# Altium schematic sheet Motor_Control.SchDoc
size A
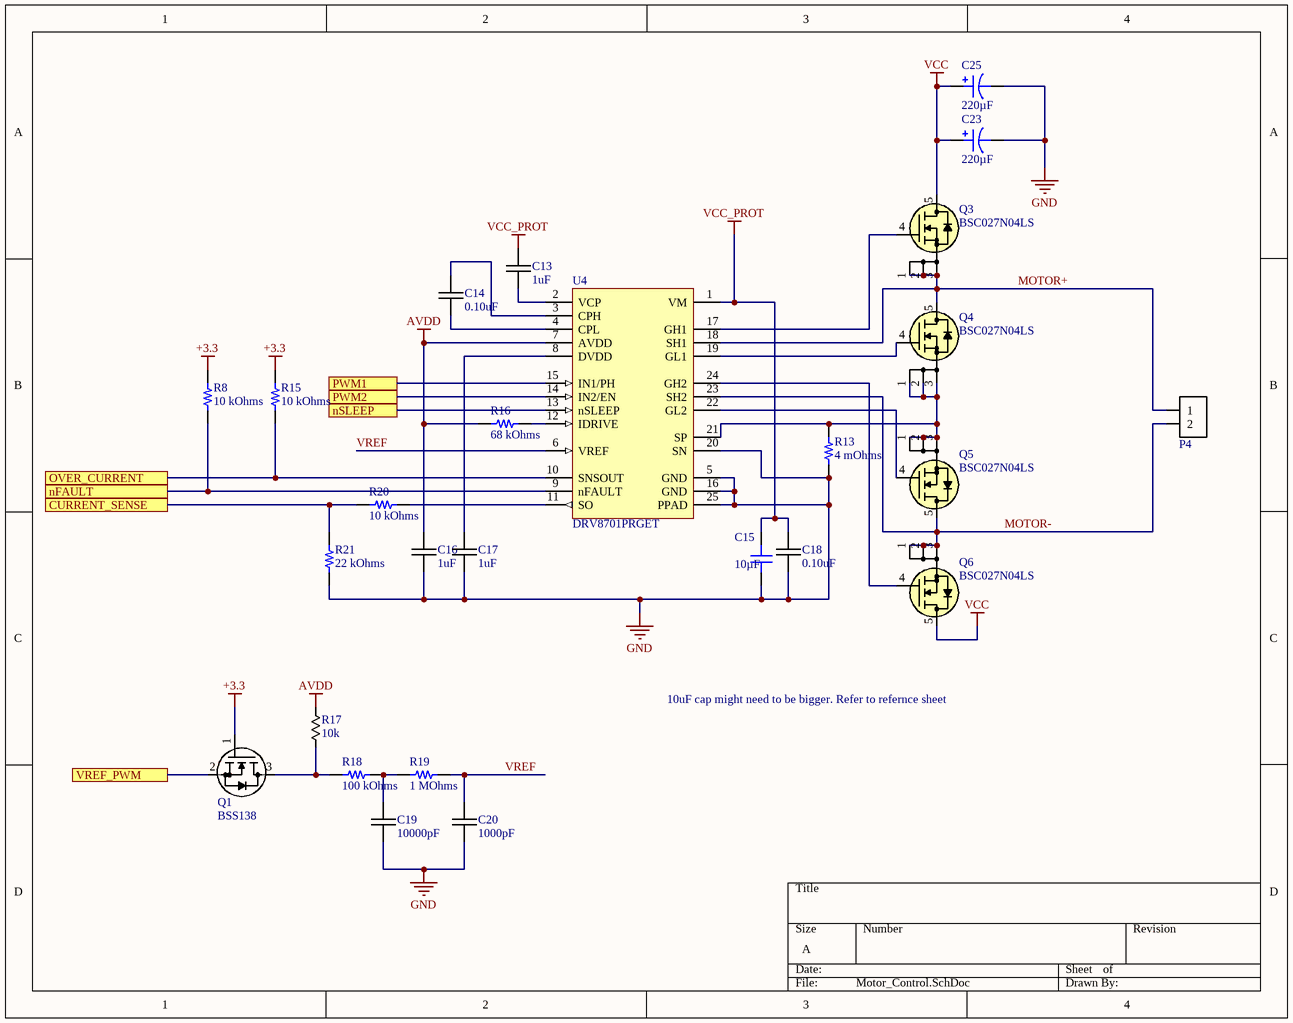
[diagram p0: Motor_Control.SchDoc]

## Parts
C13  1uF  [chip_0805]
C14  0.10uF  [chip_0805]
C15  10µF  [CAP 1206_3216 - 1.8MM]
C16  1uF  [chip_0805]
C17  1uF  [chip_0805]
C18  0.10uF  [chip_0805]
C19  10000pF  [chip_0805]
C20  1000pF  [chip_0603]
C23  220µF  [CAP TH ALUM ELEC D10.00mm S5.00mm H13.50mm]
C25  220µF  [CAP TH ALUM ELEC D10.00mm S5.00mm H13.50mm]
P4  conn-2x1_0  [BARR_0.5IN_2x1_0]  (value not drawn)
Q1  Manufacturer PN: BSS138  [sot-23-3]  (hidden comment: n-mosfet_1)
Q3  BSC027N04LS  [TDFN-8-5x6]
Q4  BSC027N04LS  [TDFN-8-5x6]
Q5  BSC027N04LS  [TDFN-8-5x6]
Q6  BSC027N04LS  [TDFN-8-5x6]
R8  10 kOhms  [RES 0805_2012]
R13  4 mOhms  [RES 2512_6432]
R15  10 kOhms  [RES 0805_2012]
R16  68 kOhms  [RES 0805_2012]
R17  10k  [chip_0805]
R18  100 kOhms  [RES 0603_1608]
R19  1 MOhms  [RES 0603_1608]
R20  10 kOhms  [RES 0805_2012]
R21  22 kOhms  [RES 0805_2012]
U4  DRV8701PRGET  [VQFN-24-EP]

## Ports
CURRENT_SENSE, nFAULT, nSLEEP, OVER_CURRENT, PWM1, PWM2, VREF_PWM

## Nets
+3.3: Q1.1(G) R8.2 R15.2
AVDD: C16.1 R16.1 R17.1 U4.7(AVDD)
GND: C15.1 C16.2 C17.2 C18.2 C19.2 C20.2 C23.2 C25.2 R13.1 R21.1 U4.5(GND) U4.16(GND) U4.20(SN) U4.25(PPAD)
VCC: C23.1 C25.1 Q3.5(D) Q6.5(D)
VCC_PROT: C13.1 C15.2 C18.1 U4.1(VM)
CURRENT_SENSE: R20.2 R21.2 ; port CURRENT_SENSE
MOTOR+: P4.1 Q3.1(S) Q3.2(S) Q3.3(S) Q4.5(D) U4.18(SH1)
MOTOR-: P4.2 Q5.5(D) Q6.1(S) Q6.2(S) Q6.3(S) U4.23(SH2)
nFAULT: R8.1 U4.9(nFAULT) ; port nFAULT
nSLEEP: U4.13(nSLEEP) ; port nSLEEP
OVER_CURRENT: R15.1 U4.10(SNSOUT) ; port OVER_CURRENT
PWM1: U4.15(IN1/PH) ; port PWM1
PWM2: U4.14(IN2/EN) ; port PWM2
VREF: C20.1 R19.2 U4.6(VREF)
VREF_PWM: Q1.2(S) ; port VREF_PWM
NetC13_2: C13.2 U4.2(VCP)
NetC14_1: C14.1 U4.3(CPH)
NetC14_2: C14.2 U4.4(CPL)
NetC17_1: C17.1 U4.8(DVDD)
NetC19_1: C19.1 R18.2 R19.1
NetQ1_3: Q1.3(D) R17.2 R18.1
NetQ3_4: Q3.4(G) U4.17(GH1)
NetQ4_1: Q4.1(S) Q4.2(S) Q4.3(S) Q5.1(S) Q5.2(S) Q5.3(S) R13.2 U4.21(SP)
NetQ4_4: Q4.4(G) U4.19(GL1)
NetQ5_4: Q5.4(G) U4.22(GL2)
NetQ6_4: Q6.4(G) U4.24(GH2)
NetR16_2: R16.2 U4.12(IDRIVE)
NetR20_1: R20.1 U4.11(SO)

## Notes on the sheet
- 10uF cap might need to be bigger. Refer to refernce sheet

## Library data of the parts
C13 C16 C17 = CAP-00109: CAP, 1uF, 10%, 50V, X7R, 0805; Manufacturer: Murata; Manufacturer PN: GRM21BR71H105KA12L; Part Number: CAP-00109; Capacitance: 1uF; Tolerance: 10%; Voltage Rating: 50V; Type: X7R
C14 C18 = CAP-00070: CAP, 0.10uF, 10%, 50V, X7R, 0805; Manufacturer: Murata; Manufacturer PN: GRM21BR71H104KA01L; Part Number: CAP-00070; Capacitance: 0.10uF; Tolerance: 10%; Voltage Rating: 50V; Type: X7R
C15 = CL31B106KBHNNNE: CAP CER 10UF 50V X7R 1206; Manufacturer: Samsung Electro-Mechanics; Tolerance: ±10%; Part Number: CL31B106KBHNNNE; Value: 10µF; Applications: General Purpose; Capacitance: 10µF; ComponentLink1Description: Datasheet; ComponentLink1URL: http://www.samsungsem.com/kr/support/product-search/mlcc/CL31B106KBHNNNE.jsp; ComponentLink2Description: DigiKey Link; ComponentLink2URL: http://digikey.com/product-detail/en/samsung-electro-mechanics/CL31B106KBHNNNE/1276-6767-1-ND/5961626; Device Package: 1206 (3216 Metric); LastUpdated: 9/2/2020 1:05:42 AM; Lifecycle Status: Active; Minimum Order: 1; Mounting Type: Surface Mount, MLCC; Operating Temperature: -55°C ~ 125°C; Package / Case: 1206 (3216 Metric); Packaging: TapeAndReel; PartId: 19563; Part Status: Active; Price: 0.09; Series: CL; Size / Dimension: 0.126" L x 0.063" W (3.20mm x 1.60mm); Supplier 1: DigiKey; Supplier Part Number 1: 1276-6767-1-ND; Temperature Coefficient: X7R; Thickness (Max): 0.071" (1.80mm); Voltage - Rated: 50V
C19 = CAP-00040: CAP, 10000pF, 10%, 50V, X7R, 0805; Manufacturer: Murata; Manufacturer PN: GRM216R71H103KA01D; Part Number: CAP-00040; Capacitance: 10000pF; Tolerance: 10%; Voltage Rating: 50V; Type: X7R
C20 = CAP-00457: CAP, 1000pF, ±1%, 50V, C0G, 0603; Manufacturer: Murata; Manufacturer PN: GRM1885C1H102FA01D; Part Number: CAP-00457; Capacitance: 1000pF; Tolerance: ±1%; Voltage Rating: 50V; Type: C0G
C23 C25 = ECA-1HHG221B: CAP ALUM 220UF 50V 20% RADIAL; Manufacturer: Panasonic Electronic Components; Lifetime @ Temp.: 2000 Hrs @ 105°C; Polarization: Polar; Ripple Current @ High Frequency: 450mA @ 100kHz; Ripple Current @ Low Frequency: 300mA @ 120Hz; Part Number: ECA-1HHG221B; Applications: General Purpose; Capacitance: 220µF; ComponentLink1Description: Datasheet; ComponentLink1URL: http://industrial.panasonic.com/www-cgi/jvcr13pz.cgi?E+PZ+3+ABA0026+ECA1HHG221B+7+WW; ComponentLink2Description: DigiKey Link; ComponentLink2URL: http://digikey.com/product-detail/en/panasonic-electronic-components/ECA-1HHG221B/P19447CT-ND/679887; Device Package: Radial, Can; Height - Seated (Max): 0.532" (13.50mm); LastUpdated: 9/2/2020 1:31:06 AM; Lead Spacing: 0.197" (5.00mm); Lifecycle Status: Active; Minimum Order: 1; Mounting Type: Through Hole; Operating Temperature: -55°C ~ 105°C; Package / Case: Radial, Can; Packaging: TapeAndBox; PartId: 10807; Part Status: Active; Price: 0.19; Series: NHG; Size / Dimension: 0.394" Dia (10.00mm); Supplier 1: DigiKey; Supplier Part Number 1: P19447CT-ND; Tolerance: ±20%; Value: 220µF; Voltage - Rated: 50V
P4 = CONN-00001: Barrier Blk, 2 Pos, 50 A; Manufacturer: Molex; Manufacturer PN: 389690002; Positions per level: 2; Levels: 1; Current: 50; Part Number: CONN-00001; Type: Barrier Block; Cost: 1.68; Weight: 7.5
Q1 = XSTR-00017: XSTR NMOS, 220mA, 50V, Vgs 1.3V, SOT-23-3; Manufacturer: ON Semi; Max Power: 360mW; Type: NFET; Max Current: 220mA; Max Voltage: 50V; Part Number: XSTR-00017; Vgs/Vce: 1.3V; Cost: 0.31
Q3-Q6 = XSTR-00049: XSTR, MOSFET N-Channel, 40V 100A TDFN-8; Manufacturer: Infineon; Max Power: 83W; Type: NMOS; Vgs/Vce: 2V; Part Number: XSTR-00049; Max Voltage: 40V; Max Current: 100A; Manufacturer PN: BSC027N04LS; Cost: 1.19
R8 R15 R20 = SG73S2ATTD103J: RES 10K OHM 5% 1/4W 0805; Manufacturer: KOA Speer Electronics, Inc.; Power (Watts): 0.25W, 1/4W; Temperature Coefficient: ±200ppm/°C; Part Number: SG73S2ATTD103J; Value: 10 kOhms; ComponentLink1Description: Datasheet; ComponentLink1URL: http://www.koaspeer.com/catimages/Products/SG73S/SG73S.pdf; ComponentLink2Description: DigiKey Link; ComponentLink2URL: http://digikey.com/product-detail/en/koa-speer-electronics-inc/SG73S2ATTD103J/2019-SG73S2ATTD103JCT-ND/10280158; Composition: Thick Film; Device Package: 0805 (2012 Metric); Features: Automotive AEC-Q200, Moisture Resistant, Pulse Withstanding; Height - Seated (Max): 0.024" (0.60mm); LastUpdated: 9/2/2020 1:14:56 AM; Lifecycle Status: Active; Minimum Order: 1; Number of Terminations: 2; Operating Temperature: -55°C ~ 155°C; Package / Case: 0805 (2012 Metric); Packaging: TapeAndReel; PartId: 40412; Part Status: Active; Price: 0.01; Ratings: AEC-Q200; Resistance: 10 kOhms; Series: SG73S; Size / Dimension: 0.079" L x 0.049" W (2.00mm x 1.25mm); Supplier 1: DigiKey; Supplier Part Number 1: 2019-SG73S2ATTD103JCT-ND; Supplier Device Package: 0805; Tolerance: ±5%
R13 = PA2512FKE7T0R004E: RES 0.004 OHM 1% 3W 2512; Manufacturer: Yageo; Temperature Coefficient: ±50ppm/°C; Part Number: PA2512FKE7T0R004E; ComponentLink1Description: Datasheet; ComponentLink1URL: http://www.yageo.com/documents/recent/PYu-PA_E_51_RoHS_10.pdf; ComponentLink2Description: DigiKey Link; ComponentLink2URL: http://digikey.com/product-detail/en/yageo/PA2512FKE7T0R004E/YAG6087CT-ND/9696541; Composition: Metal Element; Device Package: 2512 (6432 Metric); Features: Automotive AEC-Q200, Current Sense, Moisture Resistant; Height - Seated (Max): 0.035" (0.88mm); LastUpdated: 9/2/2020 1:27:06 AM; Lifecycle Status: Active; Minimum Order: 1; Number of Terminations: 2; Operating Temperature: -55°C ~ 170°C; Package / Case: 2512 (6432 Metric); Packaging: TapeAndReel; Part Status: Active; Power (Watts): 3W; Price: 0.32; Ratings: AEC-Q200; Resistance: 4 mOhms; Series: PA_E; Size / Dimension: 0.250" L x 0.125" W (6.35mm x 3.18mm); Supplier 1: DigiKey; Supplier Part Number 1: YAG6087CT-ND; Supplier Device Package: 2512; Tolerance: ±1%; Value: 4 mOhms
R16 = ERA-6ARW683V: RES 68K OHM 0.05% 1/8W 0805; Manufacturer: Panasonic Electronic Components; Power (Watts): 0.125W, 1/8W; Temperature Coefficient: ±10ppm/°C; Part Number: ERA-6ARW683V; Value: 68 kOhms; ComponentLink1Description: Datasheet; ComponentLink1URL: https://industrial.panasonic.com/cdbs/www-data/pdf/RDM0000/AOA0000C307.pdf; ComponentLink2Description: DigiKey Link; ComponentLink2URL: http://digikey.com/product-detail/en/panasonic-electronic-components/ERA-6ARW683V/P68KBSCT-ND/3073432; Composition: Thin Film; Device Package: 0805 (2012 Metric); Features: Automotive AEC-Q200; Height - Seated (Max): 0.024" (0.60mm); LastUpdated: 9/2/2020 1:14:49 AM; Lifecycle Status: Active; Minimum Order: 1; Number of Terminations: 2; Operating Temperature: -55°C ~ 155°C; Package / Case: 0805 (2012 Metric); Packaging: TapeAndReel; PartId: 43651; Part Status: Active; Price: 0.24; Ratings: AEC-Q200; Resistance: 68 kOhms; Series: ERA-6A; Size / Dimension: 0.079" L x 0.049" W (2.00mm x 1.25mm); Supplier 1: DigiKey; Supplier Part Number 1: P68KBSCT-ND; Supplier Device Package: 0805; Tolerance: ±0.05%
R17 = RES-00307: RES SMD 10K OHM 1% 1/8W 0805; Manufacturer: Rohm Semiconductor; Manufacturer PN: KTR10EZPF1002; Power Rating: 0.125W; Part Number: RES-00307; Resistance: 10k; Tolerance: 1%
R18 = CRCW0603100KFKEAHP: RES SMD 100K OHM 1% 1/4W 0603; Manufacturer: Vishay Dale; Power (Watts): 0.25W, 1/4W; Temperature Coefficient: ±100ppm/°C; Part Number: CRCW0603100KFKEAHP; Value: 100 kOhms; ComponentLink1Description: Datasheet; ComponentLink1URL: http://www.vishay.com/docs/20043/crcwhpe3.pdf; ComponentLink2Description: DigiKey Link; ComponentLink2URL: http://digikey.com/product-detail/en/vishay-dale/CRCW0603100KFKEAHP/541-100KSCT-ND/2222790; Composition: Thick Film; Device Package: 0603 (1608 Metric); Features: Automotive AEC-Q200, Pulse Withstanding; Height - Seated (Max): 0.022" (0.55mm); LastUpdated: 9/2/2020 1:10:04 AM; Lifecycle Status: Active; Minimum Order: 1; Number of Terminations: 2; Operating Temperature: -55°C ~ 155°C; Package / Case: 0603 (1608 Metric); Packaging: TapeAndReel; PartId: 14743; Part Status: Active; Price: 0.02; Ratings: AEC-Q200; Resistance: 100 kOhms; Series: CRCW-HP; Size / Dimension: 0.063" L x 0.033" W (1.60mm x 0.85mm); Supplier 1: DigiKey; Supplier Part Number 1: 541-100KSCT-ND; Supplier Device Package: 0603; Tolerance: ±1%
R19 = RCS06031M00FKEA: RES SMD 1M OHM 1% 1/4W 0603; Manufacturer: Vishay Dale; Power (Watts): 0.25W, 1/4W; Temperature Coefficient: ±100ppm/°C; Part Number: RCS06031M00FKEA; Value: 1 MOhms; ComponentLink1Description: Datasheet; ComponentLink1URL: http://www.vishay.com/docs/20065/rcse3.pdf; ComponentLink2Description: DigiKey Link; ComponentLink2URL: http://digikey.com/product-detail/en/vishay-dale/RCS06031M00FKEA/541-2803-1-ND/5867096; Composition: Thick Film; Device Package: 0603 (1608 Metric); Features: Automotive AEC-Q200, Pulse Withstanding; Height - Seated (Max): 0.020" (0.50mm); LastUpdated: 9/2/2020 1:09:49 AM; Lifecycle Status: Active; Minimum Order: 1; Number of Terminations: 2; Operating Temperature: -55°C ~ 155°C; Package / Case: 0603 (1608 Metric); Packaging: TapeAndReel; PartId: 21301; Part Status: Active; Price: 0.02; Ratings: AEC-Q200; Resistance: 1 MOhms; Series: RCS e3; Size / Dimension: 0.061" L x 0.033" W (1.55mm x 0.85mm); Supplier 1: DigiKey; Supplier Part Number 1: 541-2803-1-ND; Supplier Device Package: 0603; Tolerance: ±1%
R21 = RC0805FR-0722KL: RES SMD 22K OHM 1% 1/8W 0805; Manufacturer: Yageo; Power (Watts): 0.125W, 1/8W; Temperature Coefficient: ±100ppm/°C; Part Number: RC0805FR-0722KL; Value: 22 kOhms; ComponentLink1Description: Datasheet; ComponentLink1URL: https://www.yageo.com/upload/media/product/productsearch/datasheet/rchip/PYu-RC_Group_51_RoHS_L_10.pdf; ComponentLink2Description: DigiKey Link; ComponentLink2URL: http://digikey.com/product-detail/en/yageo/RC0805FR-0722KL/311-22.0KCRCT-ND/730683; Composition: Thick Film; Device Package: 0805 (2012 Metric); Features: Moisture Resistant; Height - Seated (Max): 0.024" (0.60mm); LastUpdated: 9/2/2020 1:15:14 AM; Lifecycle Status: Active; Minimum Order: 1; Number of Terminations: 2; Operating Temperature: -55°C ~ 155°C; Package / Case: 0805 (2012 Metric); Packaging: CutTape; PartId: 32623; Part Status: Active; Price: 0.10; Resistance: 22 kOhms; Series: RC; Size / Dimension: 0.079" L x 0.049" W (2.00mm x 1.25mm); Supplier 1: DigiKey; Supplier Part Number 1: 311-22.0KCRCT-ND; Supplier Device Package: 0805; Tolerance: ±1%
U4 = PWREG-00045: Dual Half-Bridge Driver, PWM, 5.9-45V, DRV8701P; Manufacturer: TI; Manufacturer PN: DRV8701PRGET; Part Number: PWREG-00045; Voltage Range In: 5.9 - 45V; Reg Type: Bridge Driver; Cost: 2.37